# Altium schematic sheet Sheet6.SchDoc
size A4
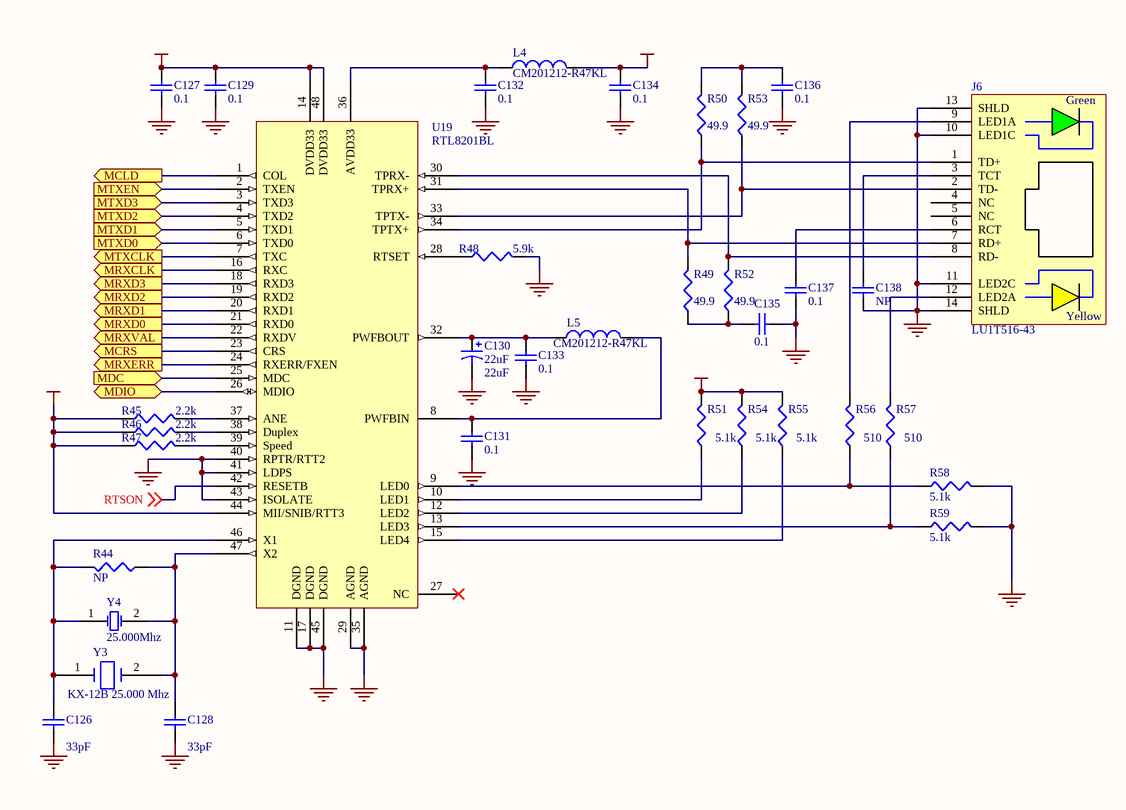
[diagram p0: Sheet6.SchDoc]

## Parts
C126  33pF  [0603]
C127  0.1  [0603]
C128  33pF  [0603]
C129  0.1  [0603]
C130  22uF  [B]
C131  0.1  [0603]
C132  0.1  [0603]
C133  0.1  [0603]
C134  0.1  [0603]
C135  0.1  [0603]
C136  0.1  [0603]
C137  0.1  [0603]
C138  NP  [0603]
J6  LU1T516-43  [LU1T516-43]
L4  CM201212-R47KL  [INDC2012-0805]
L5  CM201212-R47KL  [INDC2012-0805]
R44  NP  [CR1608-0603]
R45  2.2k  [CR1608-0603]
R46  2.2k  [CR1608-0603]
R47  2.2k  [CR1608-0603]
R48  5.9k  [CR1608-0603]
R49  49.9  [CR1608-0603]
R50  49.9  [CR1608-0603]
R51  5.1k  [CR1608-0603]
R52  49.9  [CR1608-0603]
R53  49.9  [CR1608-0603]
R54  5.1k  [CR1608-0603]
R55  5.1k  [CR1608-0603]
R56  510  [CR1608-0603]
R57  510  [CR1608-0603]
R58  5.1k  [CR1608-0603]
R59  5.1k  [CR1608-0603]
U19  RTL8201BL  [F-QFP7x7-G48/X.3N]
Y3  KX-12B 25.000 Mhz  [KX-12B]
Y4  25.000Mhz  [HC-49U]

## Ports
MCLD (out), MCRS (out), MDC (in), MDIO (bidir), MRXCLK (out), MRXD0 (out), MRXD1 (out), MRXD2 (out), MRXD3 (out), MRXERR (out), MRXVAL (out), MTXCLK (out), MTXD0 (in), MTXD1 (in), MTXD2 (in), MTXD3 (in), MTXEN (in)

## Nets
GND: C126.1 C127.1 C128.1 C129.1 C130.2 C131.1 C132.1 C133.1 C134.1 C135.1 C136.1 C137.1 C138.1 J6.10(LED1C) J6.11(LED2C) J6.13(SHLD) J6.14(SHLD) R48.2 R58.2 R59.2 U19.11(DGND) U19.17(DGND) U19.29(AGND) U19.35(AGND) U19.40(RPTR/RTT2) U19.41(LDPS) U19.43(ISOLATE) U19.45(DGND)
VCCIO: C127.2 C129.2 C134.2 L4.2 R45.1 R46.1 R47.1 R51.2 R54.2 R55.2 U19.14(DVDD33) U19.44(MII/SNIB/RTT3) U19.48(DVDD33)
MCLD: U19.1(COL) ; port MCLD
MCRS: U19.23(CRS) ; port MCRS
MDC: U19.25(MDC) ; port MDC
MDIO: U19.26(MDIO) ; port MDIO
MRXCLK: U19.16(RXC) ; port MRXCLK
MRXD0: U19.21(RXD0) ; port MRXD0
MRXD1: U19.20(RXD1) ; port MRXD1
MRXD2: U19.19(RXD2) ; port MRXD2
MRXD3: U19.18(RXD3) ; port MRXD3
MRXERR: U19.24(RXERR/FXEN) ; port MRXERR
MRXVAL: U19.22(RXDV) ; port MRXVAL
MTXCLK: U19.7(TXC) ; port MTXCLK
MTXD0: U19.6(TXD0) ; port MTXD0
MTXD1: U19.5(TXD1) ; port MTXD1
MTXD2: U19.4(TXD2) ; port MTXD2
MTXD3: U19.3(TXD3) ; port MTXD3
MTXEN: U19.2(TXEN) ; port MTXEN
RTSON: U19.42(RESETB) ; off-sheet RTSON
NetC126_2: C126.2 R44.2 U19.46(X1) Y3.1 Y4.1(OSC1)
NetC128_2: C128.2 R44.1 U19.47(X2) Y3.2 Y4.2(OSC2)
NetC130_1: C130.1 C133.2 L5.1 U19.32(PWFBOUT)
NetC131_2: C131.2 L5.2 U19.8(PWFBIN)
NetC132_2: C132.2 L4.1 U19.36(AVDD33)
NetC135_2: C135.2 R49.1 R52.1
NetC136_2: C136.2 R50.2 R53.2
NetC137_2: C137.2 J6.6(RCT)
NetC138_2: C138.2 J6.3(TCT)
NetJ6_1: J6.1(TD+) R50.1 U19.34(TPTX+)
NetJ6_2: J6.2(TD-) R53.1 U19.33(TPTX-)
NetJ6_7: J6.7(RD+) R49.2 U19.31(TPRX+)
NetJ6_8: J6.8(RD-) R52.2 U19.30(TPRX-)
NetJ6_9: J6.9(LED1A) R56.2
NetJ6_12: J6.12(LED2A) R57.2
NetR45_2: R45.2 U19.37(ANE)
NetR46_2: R46.2 U19.38(Duplex)
NetR47_2: R47.2 U19.39(Speed)
NetR48_1: R48.1 U19.28(RTSET)
NetR51_1: R51.1 U19.10(LED1)
NetR54_1: R54.1 U19.12(LED2)
NetR55_1: R55.1 U19.15(LED4)
NetR56_1: R56.1 R58.1 U19.9(LED0)
NetR57_1: R57.1 R59.1 U19.13(LED3)

Not connected (* = marked no-connect by the designer): J6 4(NC) 5(NC); U19 27(NC)*

## Notes on the sheet
- (in symbol LU1T516-43) Green; Yellow

## Library data of the parts
C126-C129 C131-C137 = C0603: Ceramic Chip Capacitor - Standard; Note: Footprint corresponds to dimensions for bulk cassette packaging. This case size has tightened tolerances.; Published: 17-Jul-2002; LatestRevisionDate: 19-Mar-2004; LatestRevisionNote: Silkscreen size reduced.; DatasheetDocument: Mar-2001; PackageDocument: Mar-2001; PackageReference: 0603; Publisher: Altium Limited; Code_JEITA: 0603; Code_IPC: 1608 [0603]; ComponentLink1Description: Manufacturer Link; ComponentLink1URL: http://www.kemet.com/; ComponentLink2Description: Datasheet; ComponentLink2URL: http://www.kemet.com/kemet/web/homepage/kechome.nsf/vapubfilesname/F3102TA.pdf/$file/F3102TA.pdf
  C126 C128: Value: 33pF
  C127 C129 C131-C137: Value: 0.1
C130 = T491B: Solid Tantalum Chip Capacitor, Standard T491 Series - Industrial Grade; Published: 17-Jul-2002; LatestRevisionDate: 19-Mar-2004; LatestRevisionNote: Silkscreen dimensions re-sized.; DatasheetDocument: Mar-2001; PackageDocument: Mar-2001; PackageReference: B; Publisher: Altium Limited; Code_JEITA: 3528-21; ComponentLink1Description: Manufacturer Link; ComponentLink1URL: http://www.kemet.com/; ComponentLink2Description: Datasheet; ComponentLink2URL: http://www.kemet.com/kemet/web/homepage/kechome.nsf/vapubfilesname/F3102TA.pdf/$file/F3102TA.pdf; Value: 22uF
C138 = C0603: Ceramic Chip Capacitor - Standard; Note: Footprint corresponds to dimensions for bulk cassette packaging. This case size has tightened tolerances.; Value: 0.1; Published: 17-Jul-2002; LatestRevisionDate: 19-Mar-2004; LatestRevisionNote: Silkscreen size reduced.; DatasheetDocument: Mar-2001; PackageDocument: Mar-2001; PackageReference: 0603; Publisher: Altium Limited; Code_JEITA: 0603; Code_IPC: 1608 [0603]; ComponentLink1Description: Manufacturer Link; ComponentLink1URL: http://www.kemet.com/; ComponentLink2Description: Datasheet; ComponentLink2URL: http://www.kemet.com/kemet/web/homepage/kechome.nsf/vapubfilesname/F3102TA.pdf/$file/F3102TA.pdf
J6 = LU1T516-43: Single RJ45 connector with integrated 10/100 BASE-TX magnetics and leds
L4 L5 = Inductor: Published: 8-Jun-2000; Revision: July-2002: Re-released for DXP Platform.; Publisher: Altium Limited; Value: CM201212-R47KL
R44-R59 = Res3: Resistor; Published: 8-Jun-2000; Revision: July-2002: Re-released for DXP Platform.; Publisher: Altium Limited
  R44: Value: NP
  R45-R47: Value: 2.2k
  R48: Value: 5.9k
  R49 R50 R52 R53: Value: 49.9
  R51 R54 R55 R58 R59: Value: 5.1k
  R56 R57: Value: 510
U19 = RTL8201BL: MII PHY
Y3 = QRZ_KX_12B: QUARTZ CRYSTAL
Y4 = ECS-10-13-1: Crystal Oscillator; Published: 17-Jul-2002; DatasheetDocument: 18-Apr-2000; PackageReference: HC-49U; Publisher: Altium Limited; ComponentLink1Description: Manufacturer Link; ComponentLink1URL: http://www.ecsxtal.com/; ComponentLink2Description: Datasheet; ComponentLink2URL: http://www.ecsxtal.com/pdf2/HC49U.PDF